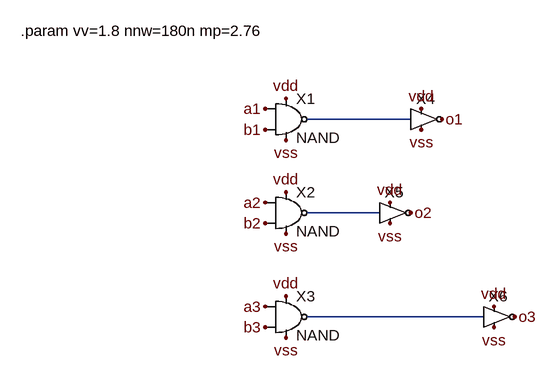
[diagram p0: schematic and3b.asc]
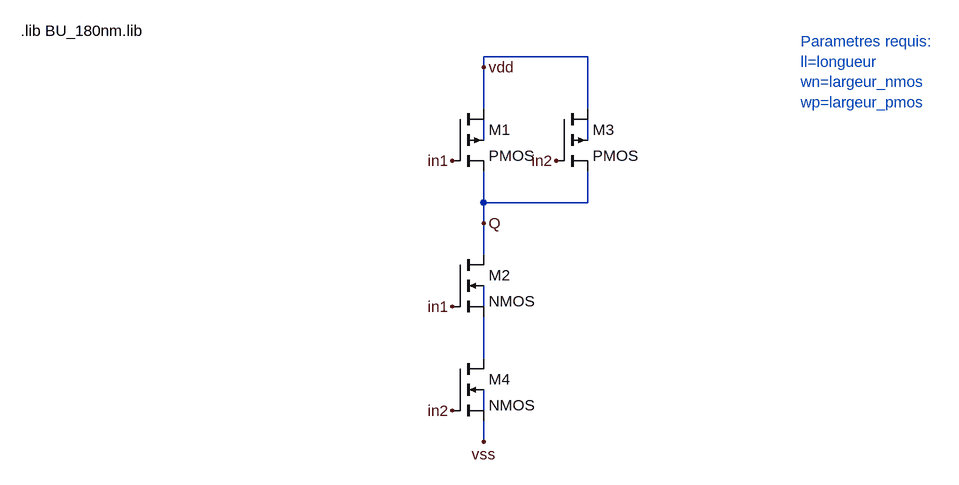
[diagram p1: sub-circuit nand.asc]
and3b.asc, the LTspice schematic file:
Version 4
SHEET 1 1616 1032
WIRE 704 80 544 80
WIRE 656 224 544 224
WIRE 816 384 544 384
FLAG 480 64 a1
FLAG 480 208 a2
FLAG 480 368 a3
FLAG 480 96 b1
FLAG 480 240 b2
FLAG 480 400 b3
FLAG 752 80 o1
FLAG 704 224 o2
FLAG 864 384 o3
FLAG 720 64 vdd
FLAG 512 112 vss
FLAG 512 256 vss
FLAG 512 416 vss
FLAG 832 400 vss
FLAG 672 240 vss
FLAG 720 96 vss
FLAG 672 208 vdd
FLAG 832 368 vdd
FLAG 512 352 vdd
FLAG 512 192 vdd
FLAG 512 48 vdd
SYMBOL nand 512 80 R0
SYMATTR InstName X1
SYMATTR SpiceLine ll=180n wn={nnw} wp={nnw*mp}
SYMBOL nand 512 224 R0
SYMATTR InstName X2
SYMATTR SpiceLine ll=180n wn={nnw} wp={nnw*mp}
SYMBOL nand 512 384 R0
SYMATTR InstName X3
SYMATTR SpiceLine ll=180n wn={nnw} wp={nnw*mp}
SYMBOL inv 720 80 R0
SYMATTR InstName X4
SYMATTR SpiceLine ll=180n wn={nnw} wp={nnw*mp}
SYMBOL inv 672 224 R0
SYMATTR InstName X5
SYMATTR SpiceLine ll=180n wn={nnw} wp={nnw*mp}
SYMBOL inv 832 384 R0
SYMATTR InstName X6
SYMATTR SpiceLine ll=180n wn={nnw} wp={nnw*mp}
TEXT 104 -56 Left 2 !.param vv=1.8 nnw=180n mp=2.76

nand.asc, the sub-circuit schematic file:
Version 4
SHEET 1 1192 836
WIRE 608 160 448 160
WIRE 448 176 448 160
WIRE 448 240 448 176
WIRE 608 240 608 160
WIRE 448 288 448 256
WIRE 608 288 608 256
WIRE 448 384 448 336
WIRE 608 384 608 336
WIRE 608 384 448 384
WIRE 448 416 448 384
WIRE 448 464 448 416
WIRE 448 544 448 512
WIRE 448 624 448 560
WIRE 448 704 448 672
WIRE 448 752 448 720
FLAG 448 176 vdd
FLAG 448 416 Q
FLAG 400 320 in1
FLAG 560 320 in2
FLAG 400 544 in1
FLAG 400 704 in2
FLAG 448 752 vss
SYMBOL pmos4 400 240 R0
SYMATTR InstName M1
SYMATTR Value2 l={ll} w={wp} ad={450n*{wp}} as={450n*{wp}} pd={900n+{wp}} ps={1080n+{wp}}
SYMBOL pmos4 560 240 R0
SYMATTR InstName M3
SYMATTR Value2 l={ll} w={wp} ad={450n*{wp}} as={450n*{wp}} pd={900n+{wp}} ps={1080n+{wp}}
SYMBOL nmos4 400 464 R0
SYMATTR InstName M2
SYMATTR Value2 l={ll} w={2*wn} ad={450n*{wn}} as={450n*{wn}} pd={900n+{wn}} ps={1080n+{wn}}
SYMBOL nmos4 400 624 R0
SYMATTR InstName M4
SYMATTR Value2 l={ll} w={2*wn} ad={450n*{wn}} as={450n*{wn}} pd={900n+{wn}} ps={1080n+{wn}}
TEXT -264 120 Left 2 !.lib BU_180nm.lib
TEXT 936 136 Left 2 ;Parametres requis: \nll=longueur \nwn=largeur_nmos \nwp=largeur_pmos

The netlist it stands for:
* and3b.asc
XX1 a1 N001 vdd vss b1 nand params: NAND ll=180n wn={nnw} wp={nnw*mp}
XX2 a2 N002 vdd vss b2 nand params: NAND ll=180n wn={nnw} wp={nnw*mp}
XX3 a3 N003 vdd vss b3 nand params: NAND ll=180n wn={nnw} wp={nnw*mp}
XX4 N001 o1 vdd vss inv ll=180n wn={nnw} wp={nnw*mp}  ; pins In _Q vdd vss
XX5 N002 o2 vdd vss inv ll=180n wn={nnw} wp={nnw*mp}  ; pins In _Q vdd vss
XX6 N003 o3 vdd vss inv ll=180n wn={nnw} wp={nnw*mp}  ; pins In _Q vdd vss

* block symbol definitions
.subckt nand in1 Q vdd vss in2
M1 vdd in1 Q N001 PMOS l={ll} w={wp} ad={450n*{wp}} as={450n*{wp}} pd={900n+{wp}} ps={1080n+{wp}}
M3 vdd in2 Q N002 PMOS l={ll} w={wp} ad={450n*{wp}} as={450n*{wp}} pd={900n+{wp}} ps={1080n+{wp}}
M2 Q in1 N004 N003 NMOS l={ll} w={2*wn} ad={450n*{wn}} as={450n*{wn}} pd={900n+{wn}} ps={1080n+{wn}}
M4 N004 in2 vss N005 NMOS l={ll} w={2*wn} ad={450n*{wn}} as={450n*{wn}} pd={900n+{wn}} ps={1080n+{wn}}
.lib BU_180nm.lib
* Parametres requis:
* ll=longueur
* wn=largeur_nmos
* wp=largeur_pmos
.ends nand

.model NMOS NMOS
.model PMOS PMOS
.lib standard.mos
.param vv=1.8 nnw=180n mp=2.76
.backanno
.end